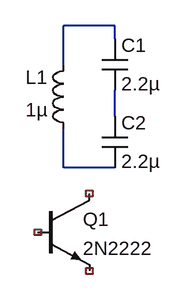
[diagram p0: schematic encoder_colpitts_oscillator.asc]
encoder_colpitts_oscillator.asc, the LTspice schematic file:
Version 4.1
SHEET 1 880 680
WIRE 224 96 160 96
WIRE 224 112 224 96
WIRE 160 144 160 96
WIRE 224 208 224 176
WIRE 160 272 160 224
WIRE 224 272 160 272
SYMBOL ind 176 240 R180
WINDOW 0 36 80 Left 2
WINDOW 3 36 40 Left 2
SYMATTR InstName L1
SYMATTR Value 1µ
SYMATTR SpiceLine Rser=1m
SYMBOL cap 208 112 R0
SYMATTR InstName C1
SYMATTR Value 2.2µ
SYMBOL cap 208 208 R0
SYMATTR InstName C2
SYMATTR Value 2.2µ
SYMBOL npn 128 304 R0
SYMATTR InstName Q1
SYMATTR Value 2N2222

The netlist it stands for:
* encoder_colpitts_oscillator.asc
L1 N003 N001 1µ Rser=1m
C1 N001 N002 2.2µ
C2 N002 N003 2.2µ
Q1 NC_01 NC_02 NC_03 0 2N2222
.model NPN NPN
.model PNP PNP
.lib standard.bjt
.backanno
.end